# EAGLE design Pmod_to_JTAG (EAGLE 9.6.2)
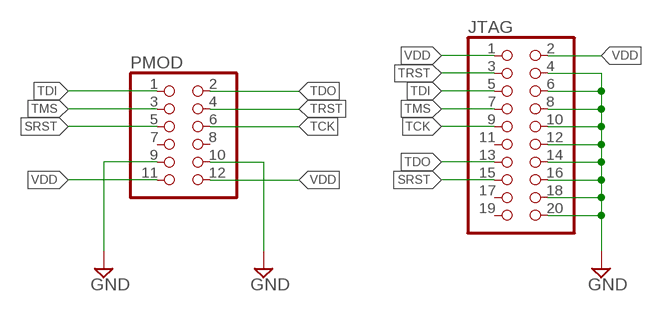
[diagram p0: schematic, sheet 1]

## Parts
JTAG  PINHD-2X10  [2X10]
PMOD  PINHD-2X6  [2X06]

## Nets
GND: JTAG.4 JTAG.6 JTAG.8 JTAG.10 JTAG.12 JTAG.14 JTAG.16 JTAG.18 JTAG.20 PMOD.9 PMOD.10
SRST: JTAG.15 PMOD.5
TCK: JTAG.9 PMOD.6
TDI: JTAG.5 PMOD.1
TDO: JTAG.13 PMOD.2
TMS: JTAG.7 PMOD.3
TRST: JTAG.3 PMOD.4
VDD: JTAG.1 JTAG.2 PMOD.11 PMOD.12
Unconnected: JTAG.11 JTAG.17 JTAG.19 PMOD.7 PMOD.8

## Library data of the parts
JTAG = pinhead:PINHD-2X10: PIN HEADER
PMOD = pinhead:PINHD-2X6: PIN HEADER

## Board
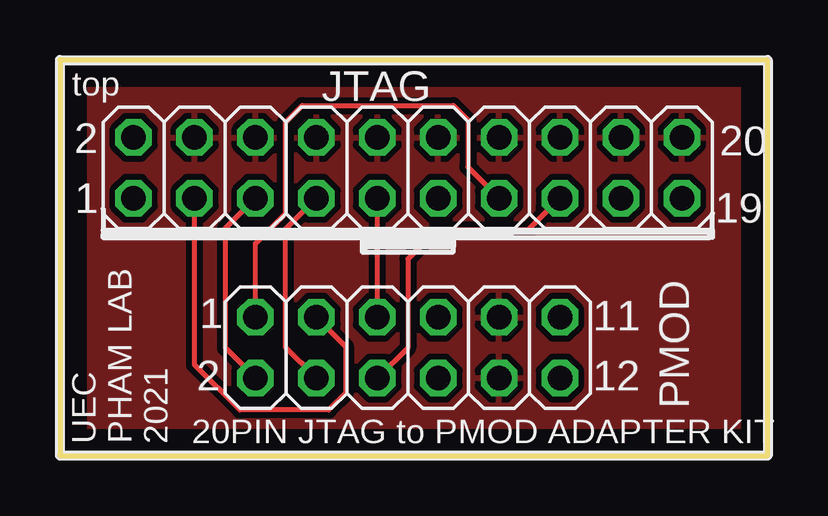
[diagram p1: board, top side]
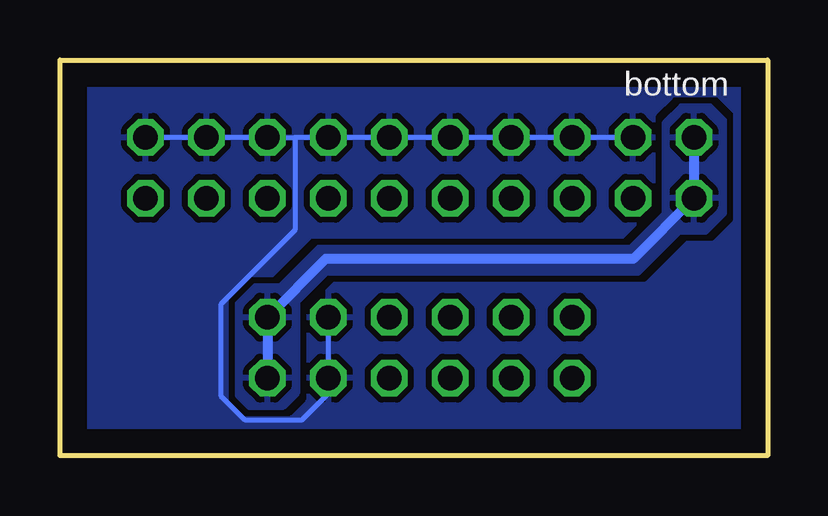
[diagram p2: board, bottom side, seen from below]

Size 29.5 x 16.5 mm. Coordinates in mm from the lower left corner, seen from the top.
Outline: 0,16.5 0,0 29.5,0 29.5,16.5 0,16.5
Copper layers (1*16): Top 0.035mm / dielectric 1.5mm / Bottom 0.035mm
Design rules "default *": minimum track width 6mil, minimum drill 0.35mm, track to track 10mil, track to pad 10mil, pad to pad 6mil, via to via 10mil, smd to smd 10mil, copper to edge 40mil, drill to drill 6mil, minimum pad ring 0.13mm, minimum via ring 0.13mm, stop-mask expansion 4mil, vias tented up to drill 0mil, thermal gap 10mil

### Footprints (pad centres in the part's own frame; a part is rotated, then mirrored left to right if it is on the bottom)
2X10 = drill 1.016 octagon: 1 -11.43,-1.27; 2 -11.43,1.27; 3 -8.89,-1.27; 4 -8.89,1.27; 5 -6.35,-1.27; 6 -6.35,1.27; 7 -3.81,-1.27; 8 -3.81,1.27; 9 -1.27,-1.27; 10 -1.27,1.27; 11 1.27,-1.27; 12 1.27,1.27; 13 3.81,-1.27; 14 3.81,1.27; 15 6.35,-1.27; 16 6.35,1.27; 17 8.89,-1.27; 18 8.89,1.27; 19 11.43,-1.27; 20 11.43,1.27
2X06 = drill 1.016 octagon: 1 -6.35,-1.27; 2 -6.35,1.27; 3 -3.81,-1.27; 4 -3.81,1.27; 5 -1.27,-1.27; 6 -1.27,1.27; 7 1.27,-1.27; 8 1.27,1.27; 9 3.81,-1.27; 10 3.81,1.27; 11 6.35,-1.27; 12 6.35,1.27

### Placement (x,y rotation side)
JTAG  14.5,12 0 top
PMOD  14.5,4.5 0 top

### Tracks (layer width: path | path; a pad name or v marks a point on that pad's centre or on a via)
GND
  Bottom 0.2: JTAG.4 JTAG.6 JTAG.8 JTAG.10 JTAG.12 JTAG.14 19.7,13.27 | 19.7,13.27 JTAG.16 JTAG.18 JTAG.20 | 19.7,13.27 19.7,9.4 22.8,6.3 22.8,2.5 21.8,1.5 19.4,1.5 18.31,2.59 PMOD.9 PMOD.10
  pour Top (rank 2): 0,16.5 29.5,16.5 29.5,0 0,0
  pour Bottom (rank 2): 0,16.5 29.5,16.5 29.5,0 0,0
SRST
  Top 0.2: JTAG.15 19.52,9.4 15.7,9.4 14.5,8.2 14.5,4.5 PMOD.5
TCK
  Top 0.2: PMOD.6 JTAG.9
TDI
  Top 0.2: PMOD.1 6.9,4.48 6.9,9.48 JTAG.5
TDO
  Top 0.2: PMOD.2 8.15,8.85 9.4,10.1 9.4,13.9 10.1,14.6 16.4,14.6 17,14 17,12.04 JTAG.13
TMS
  Top 0.2: PMOD.3 9.4,4.52 9.4,9.44 JTAG.7
TRST
  Top 0.2: PMOD.4 11.9,4.56 11.9,2.6 11.2,1.9 7.5,1.9 5.61,3.79 JTAG.3
VDD
  Bottom 0.406: JTAG.2 JTAG.1 5.6,8.2 18.42,8.2 PMOD.12 PMOD.11
  pour Bottom: 2.4,14.6 1.8,14 1.8,10.1 2.6,9.3 3.7,9.3 5.4,7.6 18.4,7.6 19.6,6.4 19.6,2.6 20.2,2 21.6,2 22.1,2.5 22.1,6.4 21.4,7.1 20.3,7.1 18.7,8.7 5.7,8.7 4.3,10.1 4.3,13.9 3.6,14.6

### Text on the board
tNames: top | 2 | 20 | 1 | 19 | 1 | 11 | 2 | 12 | UEC | PHAM LAB | 2021 | 20PIN JTAG to PMOD ADAPTER KIT
bNames: bottom